# EAGLE schematic untitled (EAGLE 9.3.0)
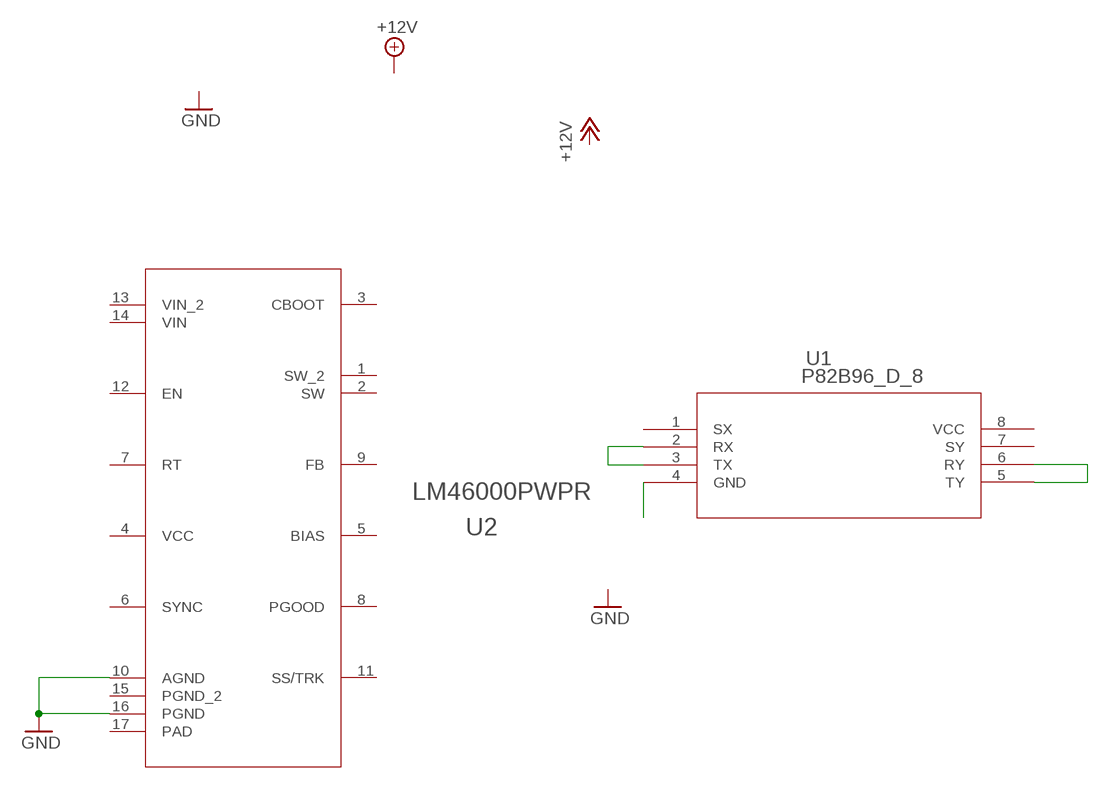
[diagram p0: schematic, sheet 1]

## Parts
U1  P82B96_D_8  [D8]
U2  LM46000PWPR  [PWP0016F]

## Nets
GND: U2.10(AGND) U2.16(PGND)
N$1: U1.2(RX) U1.3(TX)
N$2: U1.4(GND)
RY: U1.5(TY) U1.6(RY)
Unconnected: U1.1(SX) U1.7(SY) U2.3(CBOOT) U2.6(SYNC) U2.7(RT) U2.8(PGOOD) U2.9(FB) U2.11(SS/TRK) U2.12(EN)

## Power pins joined to a net without a drawn wire
BIAS: U2.5(BIAS)
PAD: U2.17(PAD)
PGND_2: U2.15(PGND_2)
SW: U2.2(SW)
SW_2: U2.1(SW_2)
VCC: U1.8(VCC) U2.4(VCC)
VIN: U2.14(VIN)
VIN_2: U2.13(VIN_2)

## Library data of the parts
U1 = BusBuffer:P82B96_D_8; DATASHEETURL: httpwww.ti.comlitgpnP82B96; FAMILY_NAME: I2C HUB BUFFER REPEATER; GENERIC_PART_NUMBER: P82B96; INDUSTRY_STD_PKG_TYPE: SOIC; MANUFACTURER: Texas Instruments; MANUFACTURER_PART_NUMBER: p82b96_d_8; PACKAGE_DESIGNATOR: D; PIN_COUNT: 8; VENDOR: Texas Instruments
U2 = LM46000:LM46000PWPR; ADDRESS1: Not shown in title block; ADDRESS2: Not shown in title block; ADDRESS3: Not shown in title block; ADDRESS4: Not shown in title block; ALTERNATEMANUFACTURER: None; APPROVEDBY: Not shown in title block; AUTHOR: Not shown in title block; CHECKEDBY: Not shown in title block; COMPANYNAME: Not shown in title block; COMPONENTLINK1DESCRIPTION: Datasheet Link; COMPONENTLINK1URL: NA; COMPTYPE: IC; CURRENTDATE: Not shown in title block; CURRENTTIME: Not shown in title block; DATE: Not shown in title block; DESIGNATOR: U?; DOCUMENTFULLPATHANDNAME: Not shown in title block; DOCUMENTNAME: Not shown in title block; DOCUMENTNUMBER: 1; ENGINEER: Not shown in title block; IMAGEPATH: Not shown in title block; LATESTREVISIONDATE: 20140220; MANUFACTURER: Texas Instruments; MODIFIEDDATE: Not shown in title block; MOUNTTYPE: SMT; ORGANIZATION: Not shown in title block; PACKAGEREFERENCE: PWP0016F; PARTNUMBER: LM46000PWP; PIN_COUNT: 17; PROJECTNAME: *; PUBLISHER: Texas Instruments; REVISION: Use project parameter SCH_Rev; ROHS: Y; RULE: *; SHEETNUMBER: 1; SHEETTOTAL: 1; SYMBOLCREATOR: x0208326; SYMBOLVERSION: 20140214; TIME: Not shown in title block; UM: EA